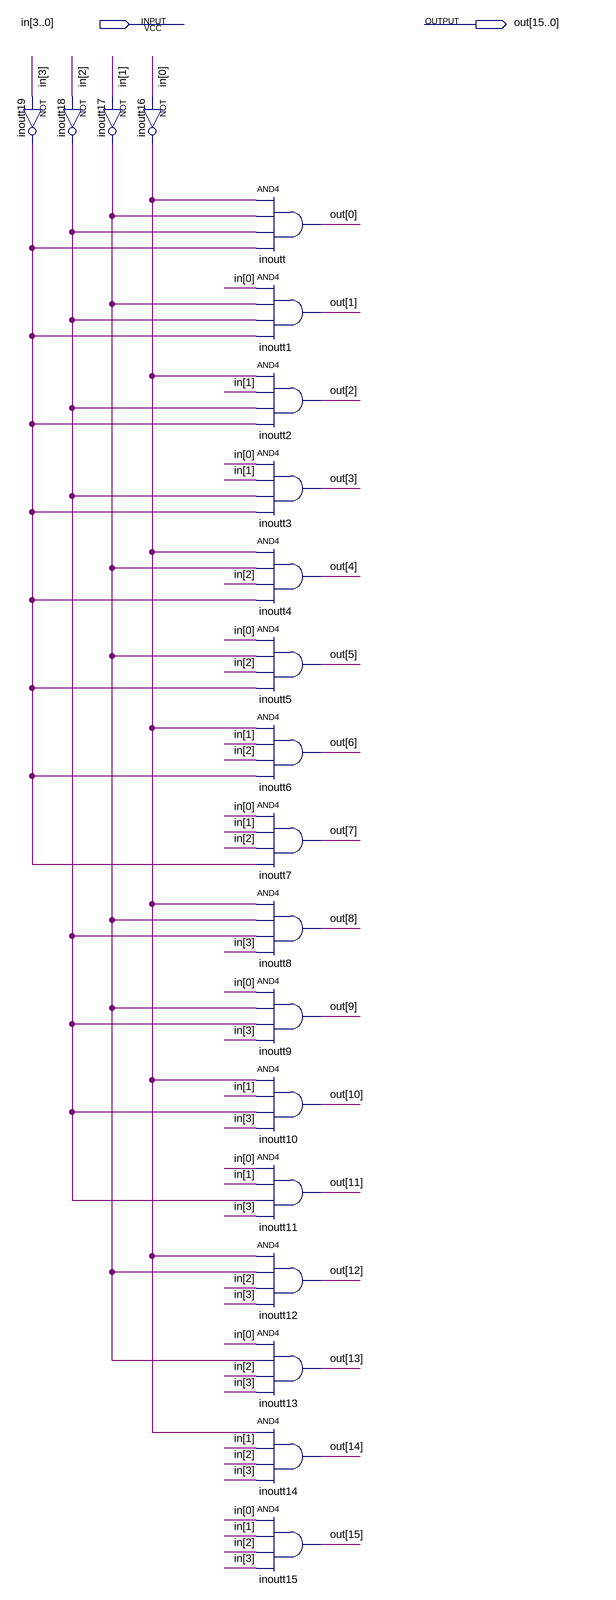
[diagram p0: schematic sheet]
// Quartus schematic Decoder_4x16.bdf as structural Verilog: 20 symbols, 2 pins
module Decoder_4x16 (
  input  [3:0] in,
  output [15:0] out
);

  wire inoutt16_out, inoutt17_out, inoutt18_out, inoutt19_out;

  not inoutt19 (inoutt19_out, in[3]);
  not inoutt17 (inoutt17_out, in[1]);
  not inoutt18 (inoutt18_out, in[2]);
  not inoutt16 (inoutt16_out, in[0]);
  and inoutt (out[0], inoutt16_out, inoutt17_out, inoutt18_out, inoutt19_out);
  and inoutt1 (out[1], in[0], inoutt17_out, inoutt18_out, inoutt19_out);
  and inoutt2 (out[2], inoutt16_out, in[1], inoutt18_out, inoutt19_out);
  and inoutt3 (out[3], in[0], in[1], inoutt18_out, inoutt19_out);
  and inoutt4 (out[4], inoutt16_out, inoutt17_out, in[2], inoutt19_out);
  and inoutt5 (out[5], in[0], inoutt17_out, in[2], inoutt19_out);
  and inoutt6 (out[6], inoutt16_out, in[1], in[2], inoutt19_out);
  and inoutt7 (out[7], in[0], in[1], in[2], inoutt19_out);
  and inoutt8 (out[8], inoutt16_out, inoutt17_out, inoutt18_out, in[3]);
  and inoutt9 (out[9], in[0], inoutt17_out, inoutt18_out, in[3]);
  and inoutt10 (out[10], inoutt16_out, in[1], inoutt18_out, in[3]);
  and inoutt11 (out[11], in[0], in[1], inoutt18_out, in[3]);
  and inoutt12 (out[12], inoutt16_out, inoutt17_out, in[2], in[3]);
  and inoutt13 (out[13], in[0], inoutt17_out, in[2], in[3]);
  and inoutt14 (out[14], inoutt16_out, in[1], in[2], in[3]);
  and inoutt15 (out[15], in[0], in[1], in[2], in[3]);
endmodule
